# Altium schematic sheet Analog.SchDoc
size B; SheetNumber: 3; SheetTotal: 3
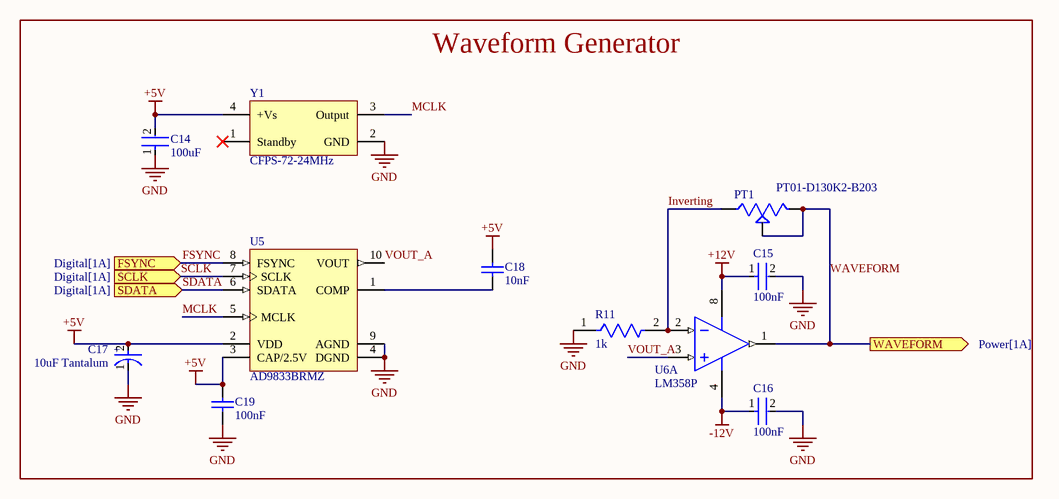
[diagram p0: Analog.SchDoc]

## Parts
C14  100uF  [FP-C1206C-EB-MFG]
C15  100nF  [FP-C1206C-EB-MFG]
C16  100nF  [FP-C1206C-EB-MFG]
C17  10uF Tantalum  [FP-293DB-MFG]
C18  10nF  [CAPC1206(3216)150_L]
C19  100nF  [CAPC1608X87X45LL20T05]
PT1  PT01-D130K2-B203  [TRIM_PT01-D130K2-B203]
R11  1k  [FP-MCU0805-IPC_B]
U5  AD9833BRMZ  [ADI-RM-10_M]
U6  LM358P  [P0008A]  (part A of 2)
Y1  CFPS-72-24MHz  [WE-SPXO_CFPS-72]

## Blocks framed on the sheet
Waveform Generator: C14-C19 PT1 R11 U5 U6 Y1

## Ports
FSYNC (in, see Digital[1A]), SCLK (in, see Digital[1A]), SDATA (in, see Digital[1A]), WAVEFORM (out, see Power[1A])

## Nets
+5V: C14.2 C17.2(A) C18.2 C19.2 U5.2(VDD) U5.3(CAP/2.5V) Y1.4(+Vs)
+12V: C15.1 U6.8(VCC)
-12V: C16.1 U6.4(GND)
GND: C14.1 C15.2 C16.2 C17.1(C) C19.1 R11.1 U5.4(DGND) U5.9(AGND) Y1.2(GND)
FSYNC: U5.8(FSYNC) ; port FSYNC
Inverting: PT1.3 R11.2 U6.2(1IN-)
MCLK: U5.5(MCLK) Y1.3(Output)
SCLK: U5.7(SCLK) ; port SCLK
SDATA: U5.6(SDATA) ; port SDATA
VOUT_A: U5.10(VOUT) U6.3(1IN+)
WAVEFORM: PT1.1 PT1.2 U6.1(1OUT) ; port WAVEFORM
NetC18_1: C18.1 U5.1(COMP)

Not connected (* = marked no-connect by the designer): Y1 1(Standby)*

## Notes on the sheet
- (in symbol CMP-02414-000008-1) +

## Library data of the parts
C14-C16 = CMP-03020-014955-1: C1206 0.10 μF C0G 10.00% 25 V X7R; Manufacturer: KEMET; Manufacturer Part Number: C1206C104K3GACTU; Automotive Grade: Grade 0; Voltage Rating: 25 V; Tolerance: 0.1; Material: Ceramic; Capacitance: 0.10 μF; Temperature Coefficient: 15%; Value: 0.10 μF; Category: Cap; RoHS: TRUE; Temperature Range High: +150°C; Mouser Description: Multilayer Ceramic Capacitors MLCC - SMD/SMT 25volt 0.1uF 10% C0G; Lead Free: Yes; Temperature Characteristic: C0G; Octopart: https://octopart.com/c1206c104k3gactu-kemet-12901041; Device Class L3: Ceramic Capacitors; Ipc Land Pattern Name: CAPC320160X78; Temperature Range Low: -55°C; Device Class L1: Passive Components; Temperature: -55°C to +150°C; Automotive: Yes; ComponentLink2Description: Datasheet; Device Class L2: Capacitors; ComponentLink2URL: https://content.kemet.com/datasheets/KEM_C1007_X8R_ULTRA_150C_SMD.pdf; Package: C1206C-EB; Height: 0.88mm
C17 = CMP-02414-000008-1: CAP TANT 10UF 10% 20V 1411; Leakage Current: 2uA; Dissipation Factor: 6%; Polarity: Polar; Ripple Current: 200mA; Q Factor: 6; ESR (Equivalent Series Resistance): 2.1R; Mount: Surface Mount; Case Code (Metric): 3528; Case/Package: 1411; Radiation Hardening: No; Package Quantity: 1; Case Code (Imperial): 1411; Packaging: Tape and Reel; Min Operating Temperature: -55°C; Voltage: 20V; Lead Free: Lead Free; Height: 1.9mm; Capacitance: 10uF; Construction: Flat; Voltage Rating: 20V; Termination: SMD/SMT; Series: TANTAMOUNT® 293D; Height - Seated (Max): 0.083inch; Width: 0.11inch; Voltage Rating (DC): 20V; Tolerance: 10%; RoHS Compliant: Yes; Depth: 2.8mm; Features: General Purpose; Length: 3.5mm; Dielectric Material: Tantalum; Max Operating Temperature: 125°C
C18 = CMP-1037-03452-1: CAP 10nF 10V ±5% 1206 (3216 Metric) Thickness 1.45mm SMD; Tolerance: Â±5%; Case-Metric: 3216; Case-EIA: 1206; Max Thickness: 1.45 mm; Technology: SMT; Value: 10nF; Rated Voltage: 10 V
C19 = CMP-2006-00001-1: Ceramic 100nF X7R 16V 5% 1206; Part Number: C0603X104J4RACTU; Manufacturer: Kemet
R11 = CMP-02407-004057-1: RES 1.05K OHM 0.5% 1/5W 0805
U5 = CMP-0293-00077-1: Low Power, 12.65 mW, 2.3 V to 5.5 V, Programmable Waveform Generator, 10-Bit, Serial, RM-10, 50 Tube, Pb-Free; Resolution (Bits): 10bit; Compliance Range (V): 650mV; FS Iout (mA nom): 3mA; REFCLK Multiplier: No; Master fclk: 25MHz; I Supply total (max): 5.5mA; Tuning Word Width (bits): 28bit; Code_JEDEC: MO-187-BA; DatasheetVersion: Rev. D; PackageVersion: 5/8/2005; ComponentLink1URL: www.analog.com; ComponentLink3Description: Package Specification; PackageDescription: 10-Lead Mini Small Outline Package [MSOP]; I/O Interface: Serial; ComponentLink2Description: Datasheet; ComponentLink1Description: Manufacturer URL; PackageReference: RM-10; ComponentLink2URL: http://www.analog.com/static/imported-files/data_sheets/AD9833.pdf; ComponentLink3URL: http://www.analog.com/static/imported-files/packages/PKG_PDF/MSOP%28RM%29/RM_10.pdf
U6 = CMP-2000-06549-1: Dual Operational Amplifier, 3 to 32 V, 0 to 70 degC, 8-Pin PDIP (P), RoHS, Tape and Reel; Manufacturer: Technik Industrial; Datasheet Version: Rev. T, 04/2015; Datasheet URL: http://www.ti.com/lit/ds/symlink/lm358.pdf; Manufacturer URL: http://www.technik.com.hk/; Package Description: 8-Pin Double In-line Package, Body 9.59 x 6.35 mm, Pitch 2.54 mm; Mounting Technology: ThroughHole; Package URL: http://www.ti.com/lit/ml/mpdi001b/mpdi001b.pdf; Package Reference: P8
Y1 = CMP-03913-116855899-1: 831019082 WE-SPXO Crystal Oscillator; Frequency: 24MHz; Max Operating Temperature: 70°C; Height: 1.4mm; Min Operating Temperature: 0°C; Length: 7mm; Width: 5mm; NexarPartId: 116855899
PT1 = PT01-D130K2-B203: Price: None; Package: None; Availability: Unavailable; MP: PT01-D130K2-B203; Value: *